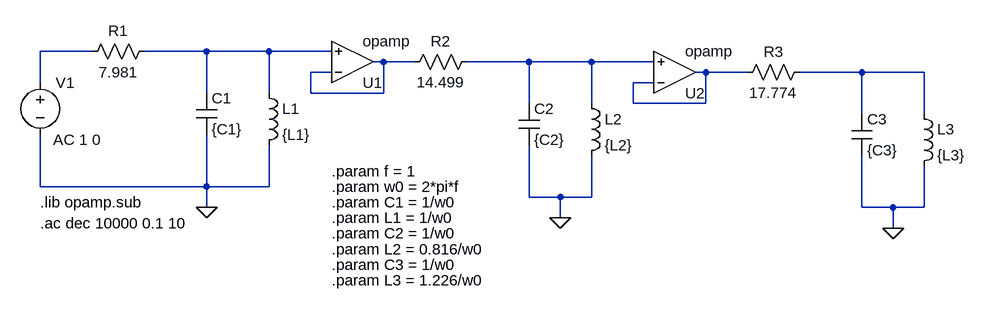
[diagram p0: schematic TS4bis2_SimulacionLTSpice.asc]
TS4bis2_SimulacionLTSpice.asc, the LTspice schematic file:
Version 4
SHEET 1 1344 688
WIRE -16 112 -96 112
WIRE 160 112 64 112
WIRE 256 112 160 112
WIRE 352 112 256 112
WIRE 432 128 416 128
WIRE 480 128 432 128
WIRE 656 128 560 128
WIRE 752 128 656 128
WIRE 848 128 752 128
WIRE 352 144 320 144
WIRE 928 144 912 144
WIRE 992 144 928 144
WIRE 1168 144 1072 144
WIRE 1264 144 1168 144
WIRE -96 160 -96 112
WIRE 848 160 816 160
WIRE 160 176 160 112
WIRE 256 176 256 112
WIRE 320 176 320 144
WIRE 432 176 432 128
WIRE 432 176 320 176
WIRE 656 192 656 128
WIRE 752 192 752 128
WIRE 816 192 816 160
WIRE 928 192 928 144
WIRE 928 192 816 192
WIRE 1168 208 1168 144
WIRE 1264 208 1264 144
WIRE -96 320 -96 240
WIRE 160 320 160 240
WIRE 160 320 -96 320
WIRE 256 320 256 256
WIRE 256 320 160 320
WIRE 656 336 656 256
WIRE 704 336 656 336
WIRE 752 336 752 272
WIRE 752 336 704 336
WIRE 160 352 160 320
WIRE 1168 352 1168 272
WIRE 1216 352 1168 352
WIRE 1264 352 1264 288
WIRE 1264 352 1216 352
WIRE 704 368 704 336
WIRE 1216 384 1216 352
FLAG 160 352 0
FLAG 704 368 0
FLAG 1216 384 0
SYMBOL voltage -96 144 R0
WINDOW 123 20 104 Left 2
WINDOW 39 0 0 Left 0
SYMATTR Value2 AC 1 0
SYMATTR InstName V1
SYMATTR Value ""
SYMBOL res 80 96 R90
WINDOW 0 0 56 VBottom 2
WINDOW 3 32 56 VTop 2
SYMATTR InstName R1
SYMATTR Value 7.981
SYMBOL ind 240 160 R0
SYMATTR InstName L1
SYMATTR Value {L1}
SYMBOL cap 144 176 R0
SYMATTR InstName C1
SYMATTR Value {C1}
SYMBOL OpAmps\\opamp 384 192 M180
SYMATTR InstName U1
SYMBOL res 576 112 R90
WINDOW 0 0 56 VBottom 2
WINDOW 3 32 56 VTop 2
SYMATTR InstName R2
SYMATTR Value 14.499
SYMBOL ind 736 176 R0
SYMATTR InstName L2
SYMATTR Value {L2}
SYMBOL cap 640 192 R0
SYMATTR InstName C2
SYMATTR Value {C2}
SYMBOL OpAmps\\opamp 880 208 M180
SYMATTR InstName U2
SYMBOL res 1088 128 R90
WINDOW 0 0 56 VBottom 2
WINDOW 3 32 56 VTop 2
SYMATTR InstName R3
SYMATTR Value 17.774
SYMBOL ind 1248 192 R0
SYMATTR InstName L3
SYMATTR Value {L3}
SYMBOL cap 1152 208 R0
SYMATTR InstName C3
SYMATTR Value {C3}
TEXT -96 344 Left 2 !.lib opamp.sub
TEXT -96 376 Left 2 !.ac dec 10000 0.1 10
TEXT 352 344 Left 2 !.param C1 = 1/w0
TEXT 352 368 Left 2 !.param L1 = 1/w0
TEXT 352 392 Left 2 !.param C2 = 1/w0
TEXT 352 416 Left 2 !.param L2 = 0.816/w0
TEXT 352 440 Left 2 !.param C3 = 1/w0
TEXT 352 464 Left 2 !.param L3 = 1.226/w0
TEXT 352 320 Left 2 !.param w0 = 2*pi*f
TEXT 352 296 Left 2 !.param f = 1

The netlist it stands for:
* TS4bis2_SimulacionLTSpice.asc
V1 N001 0 AC 1 0
R1 N002 N001 7.981
L1 N002 0 {L1}
C1 N002 0 {C1}
XU1 N003 N002 N003 opamp Aol=100K GBW=10Meg  ; pins invin noninvin out
R2 N004 N003 14.499
L2 N004 0 {L2}
C2 N004 0 {C2}
XU2 N005 N004 N005 opamp Aol=100K GBW=10Meg  ; pins invin noninvin out
R3 N006 N005 17.774
L3 N006 0 {L3}
C3 N006 0 {C3}
.lib opamp.sub
.ac dec 10000 0.1 10
.param C1 = 1/w0
.param L1 = 1/w0
.param C2 = 1/w0
.param L2 = 0.816/w0
.param C3 = 1/w0
.param L3 = 1.226/w0
.param w0 = 2*pi*f
.param f = 1
.backanno
.end